# Altium schematic sheet TCA.SchDoc: Timing Calibration
size Letter; Organization: University of California; Address1: 475 Portola Plaza; Address2: Los Angeles, CA 90095; Revision: R01; SheetNumber: 1; SheetTotal: 1
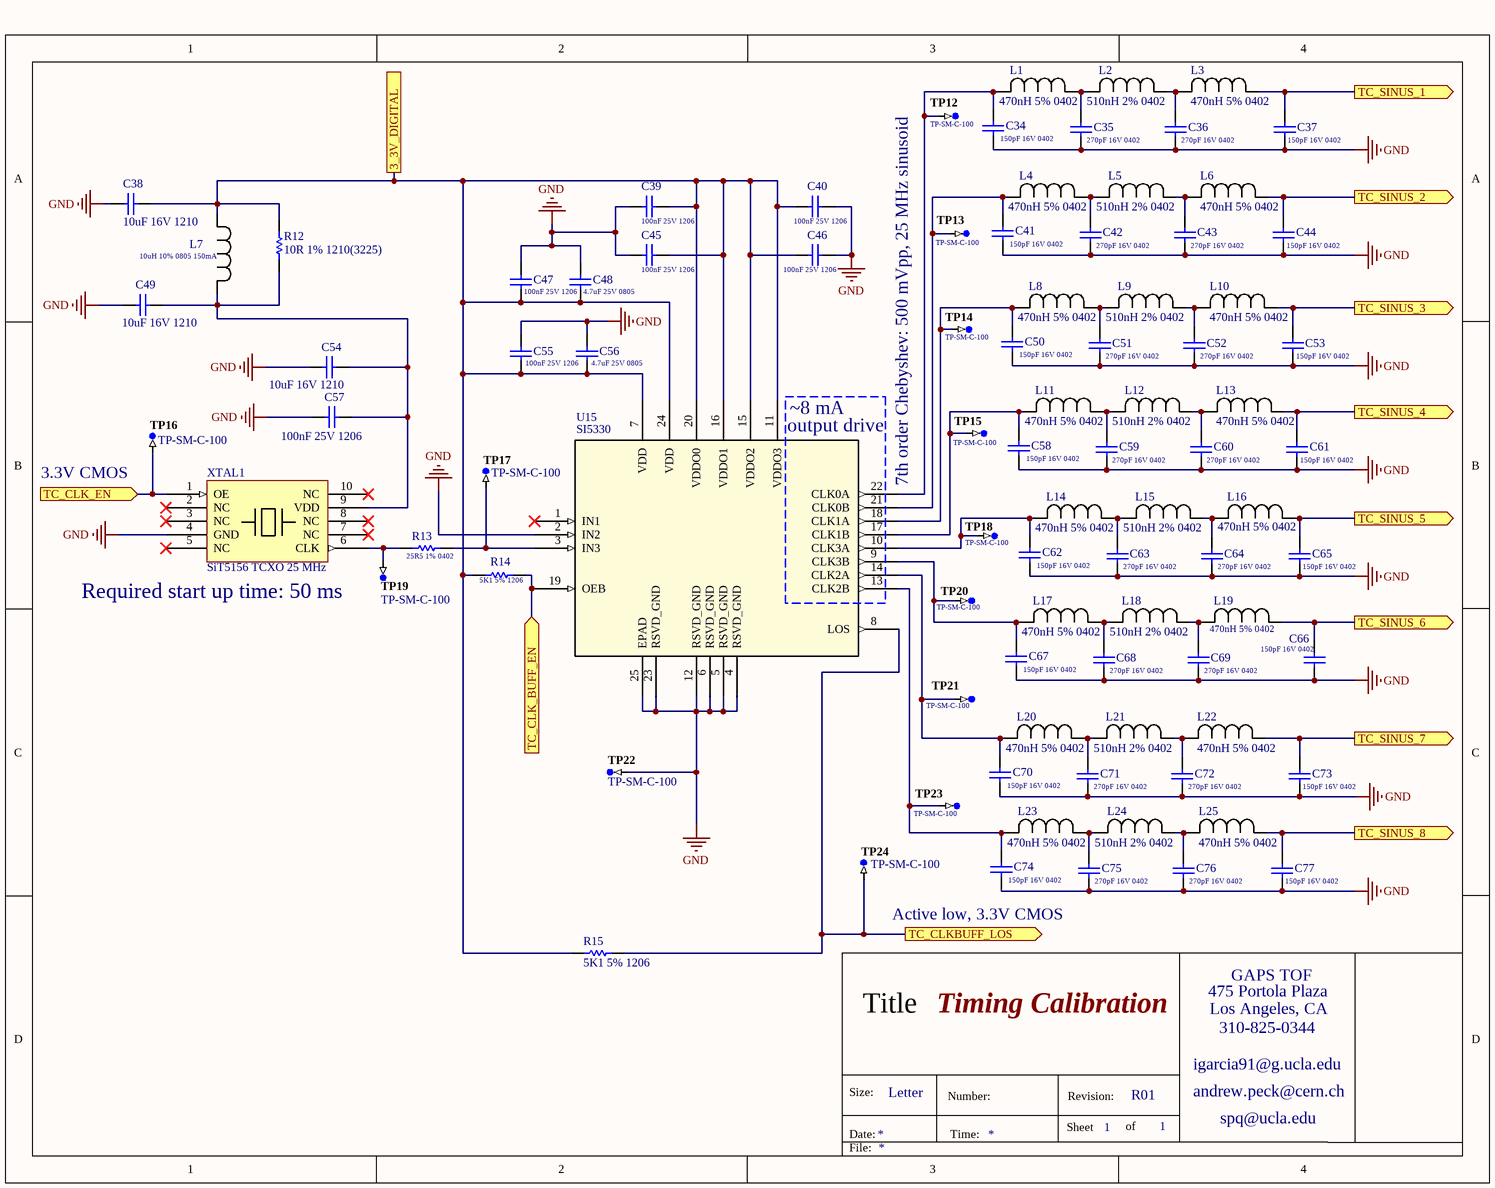
[diagram p0: TCA.SchDoc]

## Parts
C34  150pF 16V 0402  [CAPC0402(1005)60_N]
C35  270pF 16V 0402  [CAPC0402(1005)60_N]
C36  270pF 16V 0402  [CAPC0402(1005)60_N]
C37  150pF 16V 0402  [CAPC0402(1005)60_N]
C38  10uF 16V 1210  [CAPC1210(3225)280_L]
C39  100nF 25V 1206  [CAPC1206(3216)170_M]
C40  100nF 25V 1206  [CAPC1206(3216)170_M]
C41  150pF 16V 0402  [CAPC0402(1005)60_N]
C42  270pF 16V 0402  [CAPC0402(1005)60_N]
C43  270pF 16V 0402  [CAPC0402(1005)60_N]
C44  150pF 16V 0402  [CAPC0402(1005)60_N]
C45  100nF 25V 1206  [CAPC1206(3216)170_M]
C46  100nF 25V 1206  [CAPC1206(3216)170_M]
C47  100nF 25V 1206  [CAPC1206(3216)170_M]
C48  4.7uF 25V 0805  [CAPC0805(2012)145_L]
C49  10uF 16V 1210  [CAPC1210(3225)280_L]
C50  150pF 16V 0402  [CAPC0402(1005)60_N]
C51  270pF 16V 0402  [CAPC0402(1005)60_N]
C52  270pF 16V 0402  [CAPC0402(1005)60_N]
C53  150pF 16V 0402  [CAPC0402(1005)60_N]
C54  10uF 16V 1210  [CAPC1210(3225)280_L]
C55  100nF 25V 1206  [CAPC1206(3216)170_M]
C56  4.7uF 25V 0805  [CAPC0805(2012)145_L]
C57  100nF 25V 1206  [CAPC1206(3216)170_M]
C58  150pF 16V 0402  [CAPC0402(1005)60_N]
C59  270pF 16V 0402  [CAPC0402(1005)60_N]
C60  270pF 16V 0402  [CAPC0402(1005)60_N]
C61  150pF 16V 0402  [CAPC0402(1005)60_N]
C62  150pF 16V 0402  [CAPC0402(1005)60_N]
C63  270pF 16V 0402  [CAPC0402(1005)60_N]
C64  270pF 16V 0402  [CAPC0402(1005)60_N]
C65  150pF 16V 0402  [CAPC0402(1005)60_N]
C66  150pF 16V 0402  [CAPC0402(1005)60_N]
C67  150pF 16V 0402  [CAPC0402(1005)60_N]
C68  270pF 16V 0402  [CAPC0402(1005)60_N]
C69  270pF 16V 0402  [CAPC0402(1005)60_N]
C70  150pF 16V 0402  [CAPC0402(1005)60_N]
C71  270pF 16V 0402  [CAPC0402(1005)60_N]
C72  270pF 16V 0402  [CAPC0402(1005)60_N]
C73  150pF 16V 0402  [CAPC0402(1005)60_N]
C74  150pF 16V 0402  [CAPC0402(1005)60_N]
C75  270pF 16V 0402  [CAPC0402(1005)60_N]
C76  270pF 16V 0402  [CAPC0402(1005)60_N]
C77  150pF 16V 0402  [CAPC0402(1005)60_N]
L1  470nH 5% 0402  [IND_1005]
L2  510nH 2% 0402  [IND_1005]
L3  470nH 5% 0402  [IND_1005]
L4  470nH 5% 0402  [IND_1005]
L5  510nH 2% 0402  [IND_1005]
L6  470nH 5% 0402  [IND_1005]
L7  10uH 10% 0805 150mA  [IND_TAIYO_LBR201]
L8  470nH 5% 0402  [IND_1005]
L9  510nH 2% 0402  [IND_1005]
L10  470nH 5% 0402  [IND_1005]
L11  470nH 5% 0402  [IND_1005]
L12  510nH 2% 0402  [IND_1005]
L13  470nH 5% 0402  [IND_1005]
L14  470nH 5% 0402  [IND_1005]
L15  510nH 2% 0402  [IND_1005]
L16  470nH 5% 0402  [IND_1005]
L17  470nH 5% 0402  [IND_1005]
L18  510nH 2% 0402  [IND_1005]
L19  470nH 5% 0402  [IND_1005]
L20  470nH 5% 0402  [IND_1005]
L21  510nH 2% 0402  [IND_1005]
L22  470nH 5% 0402  [IND_1005]
L23  470nH 5% 0402  [IND_1005]
L24  510nH 2% 0402  [IND_1005]
L25  470nH 5% 0402  [IND_1005]
R12  10R 1% 1210(3225)  [RESC1210(3225)_N]
R13  25R5 1% 0402  [RESC0402(1005)_M]
R14  5K1 5% 1206  [RESC1206(3216)_N]
R15  5K1 5% 1206  [RESC1206(3216)_N]
TP12  TP-SM-C-100  [TP-SM-C-100]  (no BOM)
TP13  TP-SM-C-100  [TP-SM-C-100]  (no BOM)
TP14  TP-SM-C-100  [TP-SM-C-100]  (no BOM)
TP15  TP-SM-C-100  [TP-SM-C-100]  (no BOM)
TP16  TP-SM-C-100  [TP-SM-C-100]  (no BOM)
TP17  TP-SM-C-100  [TP-SM-C-100]  (no BOM)
TP18  TP-SM-C-100  [TP-SM-C-100]  (no BOM)
TP19  TP-SM-C-100  [TP-SM-C-100]  (no BOM)
TP20  TP-SM-C-100  [TP-SM-C-100]  (no BOM)
TP21  TP-SM-C-100  [TP-SM-C-100]  (no BOM)
TP22  TP-SM-C-100  [TP-SM-C-100]  (no BOM)
TP23  TP-SM-C-100  [TP-SM-C-100]  (no BOM)
TP24  TP-SM-C-100  [TP-SM-C-100]  (no BOM)
U15  SI5330  [QFN_24]
XTAL1  SiT5156 TCXO 25 MHz

## Ports
3_3V_DIGITAL, TC_CLK_BUFF_EN (in), TC_CLK_EN (in), TC_CLKBUFF_LOS (out), TC_SINUS_1 (out), TC_SINUS_2 (out), TC_SINUS_3 (out), TC_SINUS_4 (out), TC_SINUS_5 (out), TC_SINUS_6 (out), TC_SINUS_7 (out), TC_SINUS_8 (out)

## Nets
GND: C34.1 C35.1 C36.1 C37.1 C38.1 C39.2 C40.1 C41.1 C42.1 C43.1 C44.1 C45.2 C46.1 C47.2 C48.1 C49.1 C50.1 C51.1 C52.1 C53.1 C54.2 C55.2 C56.1 C57.2 C58.1 C59.1 C60.1 C61.1 C62.1 C63.1 C64.1 C65.1 C66.1 C67.1 C68.1 C69.1 C70.1 C71.1 C72.1 C73.1 C74.1 C75.1 C76.1 C77.1 TP22.1 U15.2(IN2) U15.4(RSVD_GND) U15.5(RSVD_GND) U15.6(RSVD_GND) U15.12(RSVD_GND) U15.23(RSVD_GND) U15.25(EPAD) XTAL1.4(GND)
3_3V_DIGITAL: C38.2 C39.1 C40.2 C45.1 C46.2 C47.1 C48.2 C55.1 C56.2 L7.2 R12.1 R14.2 R15.2 U15.7(VDD) U15.11(VDDO3) U15.15(VDDO2) U15.16(VDDO1) U15.20(VDDO0) U15.24(VDD) ; port 3_3V_DIGITAL
TC_CLK_BUFF_EN: R14.1 U15.19(OEB) ; port TC_CLK_BUFF_EN
TC_CLK_EN: TP16.1 XTAL1.1(OE) ; port TC_CLK_EN
TC_CLKBUFF_LOS: R15.1 TP24.1 U15.8(LOS) ; port TC_CLKBUFF_LOS
TC_SINUS_1: C37.2 L3.1 ; port TC_SINUS_1
TC_SINUS_2: C44.2 L6.1 ; port TC_SINUS_2
TC_SINUS_3: C53.2 L10.1 ; port TC_SINUS_3
TC_SINUS_4: C61.2 L13.1 ; port TC_SINUS_4
TC_SINUS_5: C65.2 L16.1 ; port TC_SINUS_5
TC_SINUS_6: C66.2 L19.1 ; port TC_SINUS_6
TC_SINUS_7: C73.2 L22.1 ; port TC_SINUS_7
TC_SINUS_8: C77.2 L25.1 ; port TC_SINUS_8
NetC34_2: C34.2 L1.2 TP12.1 U15.22(CLK0A)
NetC35_2: C35.2 L1.1 L2.2
NetC36_2: C36.2 L2.1 L3.2
NetC41_2: C41.2 L4.2 TP13.1 U15.21(CLK0B)
NetC42_2: C42.2 L4.1 L5.2
NetC43_2: C43.2 L5.1 L6.2
NetC49_2: C49.2 C54.1 C57.1 L7.1 R12.2 XTAL1.9(VDD)
NetC50_2: C50.2 L8.2 TP14.1 U15.18(CLK1A)
NetC51_2: C51.2 L8.1 L9.2
NetC52_2: C52.2 L9.1 L10.2
NetC58_2: C58.2 L11.2 TP15.1 U15.17(CLK1B)
NetC59_2: C59.2 L11.1 L12.2
NetC60_2: C60.2 L12.1 L13.2
NetC62_2: C62.2 L14.2 TP18.1 U15.10(CLK3A)
NetC63_2: C63.2 L14.1 L15.2
NetC64_2: C64.2 L15.1 L16.2
NetC67_2: C67.2 L17.2 TP20.1 U15.9(CLK3B)
NetC68_2: C68.2 L17.1 L18.2
NetC69_2: C69.2 L18.1 L19.2
NetC70_2: C70.2 L20.2 TP21.1 U15.14(CLK2A)
NetC71_2: C71.2 L20.1 L21.2
NetC72_2: C72.2 L21.1 L22.2
NetC74_2: C74.2 L23.2 TP23.1 U15.13(CLK2B)
NetC75_2: C75.2 L23.1 L24.2
NetC76_2: C76.2 L24.1 L25.2
NetR13_1: R13.1 TP19.1 XTAL1.6(CLK)
NetR13_2: R13.2 TP17.1 U15.3(IN3)

Not connected (* = marked no-connect by the designer): U15 1(IN1)*; XTAL1 2(NC)* 3(NC)* 5(NC)* 7(NC)* 8(NC)* 10(NC)*

## Notes on the sheet
- (near U15) output drive
- (near U15) ~8 mA
- (near TP16) 3.3V CMOS
- 7th order Chebyshev: 500 mVpp, 25 MHz sinusoid
- (near TP19) Required start up time: 50 ms
- Active low, 3.3V CMOS
- 475 Portola Plaza
- GAPS TOF
- Title
- igarcia91@g.ucla.edu
- Los Angeles, CA
- 310-825-0344
- Size:
- Date:
- Letter
- Number:
- Time:
- Sheet
- Revision:
- of
- andrew.peck@cern.ch
- spq@ucla.edu
- File:

## Library data of the parts
C34 C37 C41 C44 C50 C53 C58 C61 C62 C65-C67 C70 C73 C74 C77 = CMP-1034-01297-1: CAP 150pF 16V ±10% 0402 (1005 Metric) Thickness 0.6mm SMD; Tolerance: Â±10%; Case-Metric: 1005; Case-EIA: 0402; Technology: SMT; Value: 150pF; Rated Voltage: 16 V; Max Thickness: 0.6 mm
C35 C36 C42 C43 C51 C52 C59 C60 C63 C64 C68 C69 C71 C72 C75 C76 = CMP-1034-01392-1: CAP 270pF 16V ±10% 0402 (1005 Metric) Thickness 0.6mm SMD; Tolerance: Â±10%; Case-Metric: 1005; Case-EIA: 0402; Max Thickness: 0.6 mm; Rated Voltage: 16 V; Value: 270pF; Technology: SMT
C38 C49 C54 = CMP-1038-02212-1: CAP 10uF 16V ±10% 1210 (3225 Metric) Thickness 2.8mm SMD; Case-Metric: 3225; Tolerance: Â±10%; Case-EIA: 1210; Technology: SMT; Rated Voltage: 16 V; Max Thickness: 2.8 mm; Value: 10uF
C39 C40 C45-C47 C55 C57 = CMP-1037-04191-1: CAP 100nF 25V ±10% 1206 (3216 Metric) Thickness 1.7mm SMD; Case-Metric: 3216; Tolerance: Â±10%; Case-EIA: 1206; Technology: SMT; Rated Voltage: 25 V; Value: 100nF; Max Thickness: 1.7 mm
C48 C56 = CMP-1036-04895-1: CAP 4.7uF 25V ±10% 0805 (2012 Metric) Thickness 1.45mm SMD; Case-Metric: 2012; Case-EIA: 0805; Tolerance: Â±10%; Value: 4.7uF; Technology: SMT; Rated Voltage: 25 V; Max Thickness: 1.45 mm
L1 L3 L4 L6 L8 L10 L11 L13 L14 L16 L17 L19 L20 L22 L23 L25 = MLF1005VR47JT000: Fixed Inductors 470nH 5% 0.12 A 1.5 Ohms; Vendor: TDK; Built_By: EMA_UL_Team; Type: DEV; C: Copyright (C) 2015 Accelerated Designs. All rights reserved; Manufacturer_Part_Number: MLF1005VR47JT000; RefDes: RefDes; Value: Value
L2 L5 L9 L12 L15 L18 L21 L24 = MHQ1005P10NGTD25: Fixed Inductors 0402 510nH 2% 70mA 10.2ohms; Vendor: TDK; Built_By: EMA_UL_Team; Type: DEV; C: Copyright (C) 2015 Accelerated Designs. All rights reserved; Manufacturer_Part_Number: MHQ1005P10NGTD25; RefDes: RefDes; Value: Value
L7 = LBR2012T100K: Fixed Inductors 0805 10uH 468mOhms +/-10%Tol 150mA; Vendor: TAIYO YUDEN; Built_By: EMA_UL_Team; Type: DEV; C: Copyright (C) 2015 Accelerated Designs. All rights reserved; Manufacturer_Part_Number: LBR2012T100K; RefDes: RefDes; Value: Value
R12 = CMP-1015-00284-1: 10R 0.5W 1% 1210 (3225 Metric)  SMD; Value: 10.00 Ohm; Case-Metric: 3225; Case-EIA: 1210; Technology: SMT; Power: 0.5 W; Tolerance: 1 %
R13 = CMP-1011-00328-1: 25R5 0.063W 1% 0402 (1005 Metric)  SMD; Case-EIA: 0402; Case-Metric: 1005; Value: 25.50 Ohm; Tolerance: 1 %; Power: 0.063 W; Technology: SMT
R14 R15 = CMP-1014-00091-1: 5K1 0.25W 5% 1206 (3216 Metric)  SMD; Case-EIA: 1206; Value: 5100.00 Ohm; Case-Metric: 3216; Technology: SMT; Power: 0.25 W; Tolerance: 5 %
TP12-TP24 = CMP-0484-00002-2: Test Point, Surface Mount, Circular, Pad Diameter 1 mm; Manufacturer: No Vendor; PartNumber: TP-SM-C-100
U15 = SI5330: Imported; Vendor: SILICONLABS; Manufacturer_Part_Number: si5330; RefDes: RefDes; Type: DEV; Value: Value
XTAL1 = SiT5156: Crystal oscillator